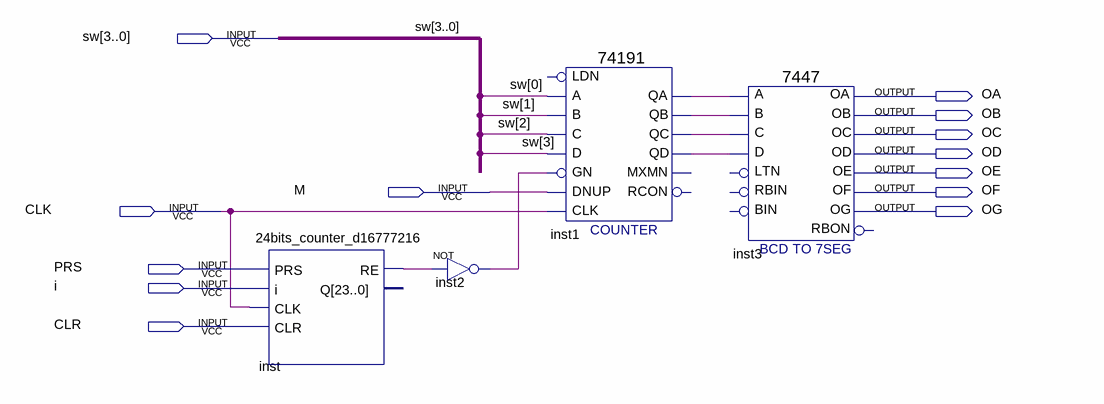
[diagram p0: schematic sheet]
// Quartus schematic the_main.bdf as structural Verilog: 4 symbols, 13 pins
module the_main (
  input  [3:0] sw,
  input  M,
  input  CLK,
  input  PRS,
  input  i,
  input  CLR,
  output OA,
  output OB,
  output OC,
  output OD,
  output OE,
  output OF,
  output OG
);

  wire inst1_qa, inst1_qb, inst1_qc, inst1_qd, inst2_out, inst_re;

  \24bits_counter_d16777216  inst (.PRS(PRS), .i(i), .CLK(CLK), .CLR(CLR), .RE(inst_re));  // open: Q
  not inst2 (inst2_out, inst_re);
  \74191  inst1 (
    .D(sw[3]), .C(sw[2]), .B(sw[1]), .A(sw[0]), .CLK(CLK), .DNUP(M), .GN(inst2_out), .QA(inst1_qa),
    .QB(inst1_qb), .QD(inst1_qd), .QC(inst1_qc));  // open: LDN, RCON, MXMN
  \7447  inst3 (
    .B(inst1_qb), .C(inst1_qc), .D(inst1_qd), .A(inst1_qa), .OB(OB), .OC(OC), .OE(OE), .OD(OD), .OF(OF),
    .OG(OG), .OA(OA));  // open: LTN, RBIN, BIN, RBON
endmodule
